# EAGLE design Backplate (EAGLE 8.0.0)
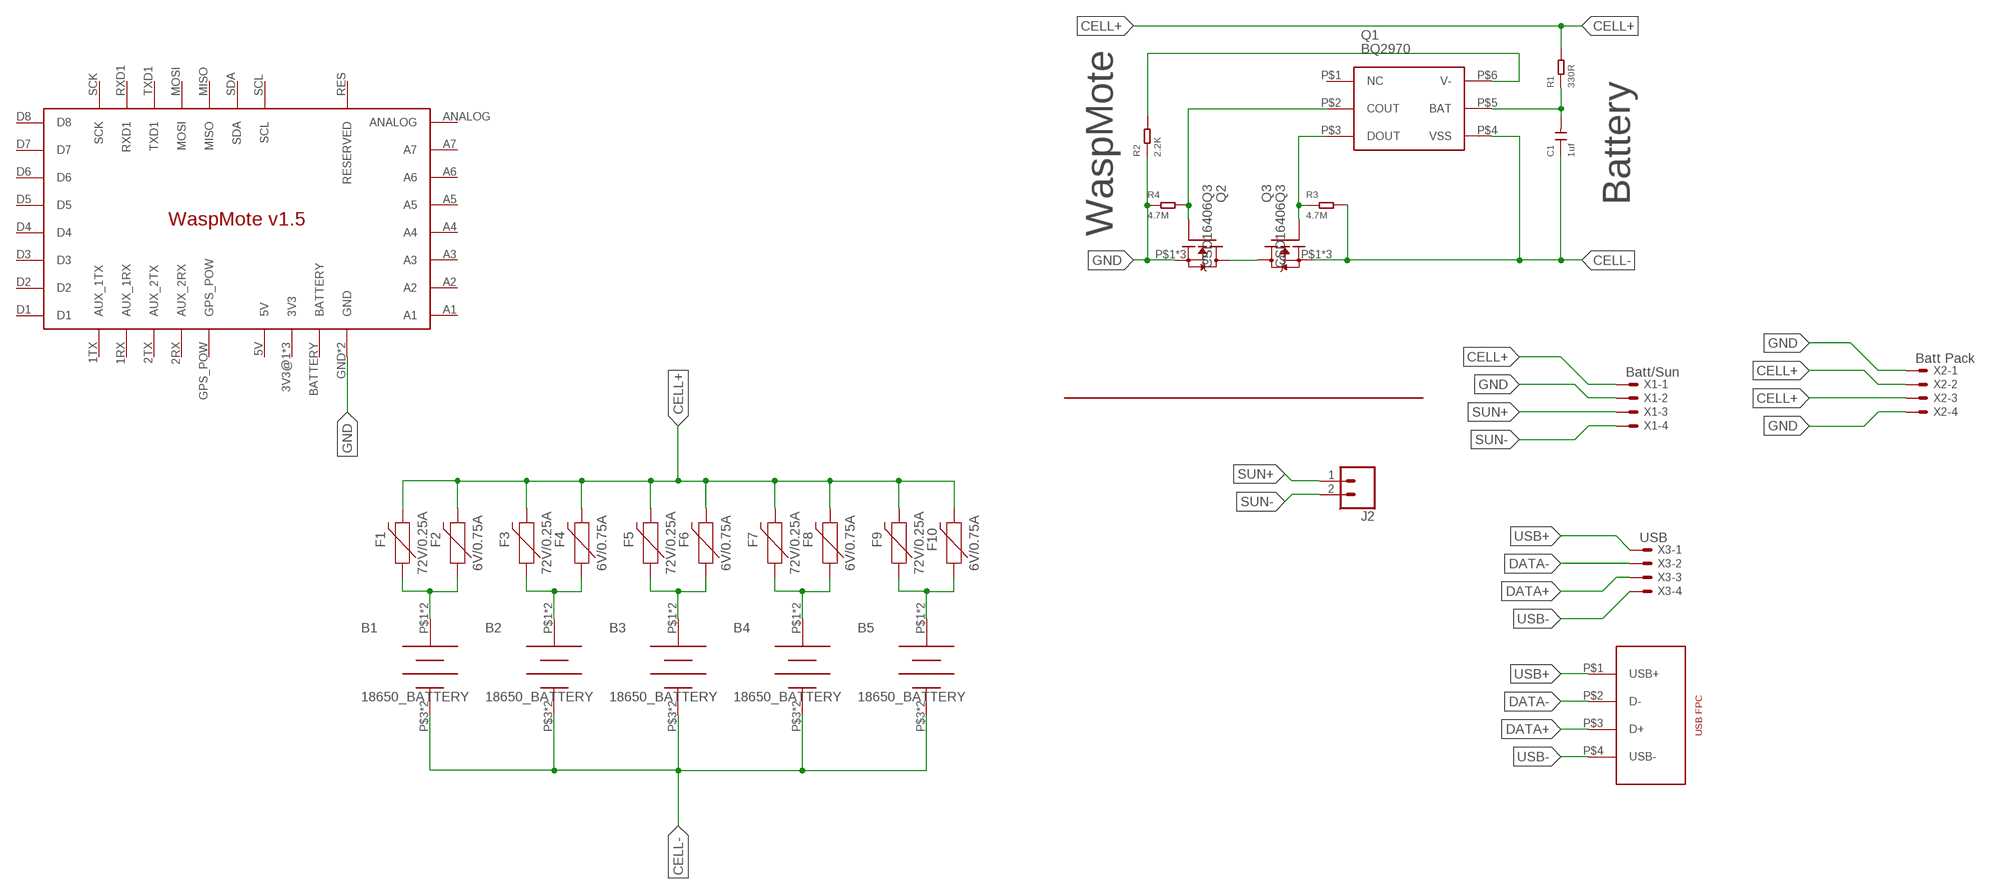
[diagram p0: schematic, sheet 1]

## Parts
B1  18650_BATTERY  [18650_BATTERY_HOLDER]
B2  18650_BATTERY  [18650_BATTERY_HOLDER]
B3  18650_BATTERY  [18650_BATTERY_HOLDER]
B4  18650_BATTERY  [18650_BATTERY_HOLDER]
B5  18650_BATTERY  [18650_BATTERY_HOLDER]
C1  1uf  CERAMIC-1UF-25V-10%-X7R(0603)  [C0603]
F1  72V/0.25A  PPTC_PTH  [PTH]
F2  6V/0.75A  PPTC_THREE-QUARTER-AMP  [1206]
F3  72V/0.25A  PPTC_PTH  [PTH]
F4  6V/0.75A  PPTC_THREE-QUARTER-AMP  [1206]
F5  72V/0.25A  PPTC_PTH  [PTH]
F6  6V/0.75A  PPTC_THREE-QUARTER-AMP  [1206]
F7  72V/0.25A  PPTC_PTH  [PTH]
F8  6V/0.75A  PPTC_THREE-QUARTER-AMP  [1206]
F9  72V/0.25A  PPTC_PTH  [PTH]
F10  6V/0.75A  PPTC_THREE-QUARTER-AMP  [1206]
J1  USB_FTP  [1MM_FPC]
J2  CONN_023.5MM_LOCK  [SCREWTERMINAL-3.5MM-2_LOCK]
Q1  BQ2970  [WSON-6]
Q2  CSD16406Q3  [CSD16406Q3]
Q3  CSD16406Q3  [CSD16406Q3]
R1  330R  SMD-RES-330R-1%-1/10W(0603)  [R0603]
R2  2.2K  SMD-RES-2.2K-5%-1/10W(0603)  [R0603]
R3  4.7M  SMD-RES-4.7M-5%-1/10W(0603)  [R0603]
R4  4.7M  SMD-RES-4.7M-5%-1/10W(0603)  [R0603]
U$12  WASPMOTE_V1.5  [WASPMOTE_V1.5]
X1  Batt/Sun  22-23-2041  [22-23-2041]
X2  Batt Pack  22-23-2041  [22-23-2041]
X3  USB  22-23-2041  [22-23-2041]

## Nets
CELL+: F1.P$2 F2.2 F3.P$2 F4.2 F5.P$2 F6.2 F7.P$2 F8.2 F9.P$2 F10.2 R1.2 X1.1 X2.2 X2.3
CELL-: B1.P$3(BATT-) B1.P$4(BATT-) B2.P$3(BATT-) B2.P$4(BATT-) B3.P$3(BATT-) B3.P$4(BATT-) B4.P$3(BATT-) B4.P$4(BATT-) B5.P$3(BATT-) B5.P$4(BATT-) C1.1 Q1.P$4(VSS) Q3.P$1(S) Q3.P$2(S) Q3.P$3(S) R3.2
D: Q2.P$5(D) Q2.P$6(D) Q2.P$7(D) Q2.P$8(D) Q3.P$5(D) Q3.P$6(D) Q3.P$7(D) Q3.P$8(D)
DATA+: J1.P$3(D+) X3.3
DATA-: J1.P$2(D-) X3.2
GND: Q2.P$1(S) Q2.P$2(S) Q2.P$3(S) R2.1 R4.1 U$12.GND U$12.GND_2(GND) X1.2 X2.1 X2.4
N$2: Q1.P$3(DOUT) Q3.P$4(G) R3.1
N$3: B1.P$1(BATT+) B1.P$2(BATT+) F1.P$1 F2.1
N$4: B2.P$1(BATT+) B2.P$2(BATT+) F3.P$1 F4.1
N$5: B3.P$1(BATT+) B3.P$2(BATT+) F5.P$1 F6.1
N$6: B4.P$1(BATT+) B4.P$2(BATT+) F7.P$1 F8.1
N$7: B5.P$1(BATT+) B5.P$2(BATT+) F9.P$1 F10.1
N$8: Q1.P$2(COUT) Q2.P$4(G) R4.2
N$10: Q1.P$6(V-) R2.2
N$12: C1.2 Q1.P$5(BAT) R1.1
SUN+: J2.1 X1.3
SUN-: J2.2 X1.4
USB+: J1.P$1(USB+) X3.1
USB-: J1.P$4(USB-) X3.4
Unconnected: Q1.P$1(NC) U$12.1RX(AUX_1RX) U$12.1TX(AUX_1TX) U$12.2RX(AUX_2RX) U$12.2TX(AUX_2TX) U$12.3V3@1(3V3) U$12.3V3@2(3V3) U$12.3V3@3(3V3) U$12.5V U$12.A1 U$12.A2 U$12.A3 U$12.A4 U$12.A5 U$12.A6 U$12.A7 U$12.ANALOG U$12.BATTERY U$12.D1 U$12.D2 U$12.D3 U$12.D4 U$12.D5 U$12.D6 U$12.D7 U$12.D8 U$12.GPS_POW U$12.MISO U$12.MOSI U$12.RES(RESERVED) U$12.RXD1 U$12.SCK U$12.SCL U$12.SDA U$12.TXD1

## Notes on the sheet
- WaspMote | Battery

## Library data of the parts
B1-B5 = UIO-John:18650_BATTERY
C1 = Seeed-Capacitor:CERAMIC-1UF-25V-10%-X7R(0603): 302010139; MPN: CC0603KRX7R8BB105
F1 F3 F5 F7 F9 = SparkFun-Fuses:PPTC: Resettable Fuse PPTC Resettable Fuse. Really a sort of resistor with a polymeric positive temperature coefficient whose resistance increases dramatically with an increase in temperature. When heated by the power passing through the resistance rises causing the current to be limited, protecting the circuit. This is achieved by the transition of the polymer from a crystalline to an amorphous state where the conductive carbon separates breaking the conductive pathways found in the cool crystalline structure. When a PPTC cools back down it resumes conducting letting the circuit turn back on. SparkFun Products: SparkFun RedBoard - Programmed with Arduino <https://www.sparkfun.com/products/12757> Pro Micro - 5V/16MHz <https://www.sparkfun.com/products/12640> Arduino Pro 328 - 5V/16MHz <https://www.sparkfun.com/products/10915> MP3 Trigger <https://www.sparkfun.com/products/13720>; PROD_ID: RES-08490
F2 F4 F6 F8 F10 = SparkFun-Fuses:PPTC: Resettable Fuse PPTC Resettable Fuse. Really a sort of resistor with a polymeric positive temperature coefficient whose resistance increases dramatically with an increase in temperature. When heated by the power passing through the resistance rises causing the current to be limited, protecting the circuit. This is achieved by the transition of the polymer from a crystalline to an amorphous state where the conductive carbon separates breaking the conductive pathways found in the cool crystalline structure. When a PPTC cools back down it resumes conducting letting the circuit turn back on. SparkFun Products: SparkFun RedBoard - Programmed with Arduino <https://www.sparkfun.com/products/12757> Pro Micro - 5V/16MHz <https://www.sparkfun.com/products/12640> Arduino Pro 328 - 5V/16MHz <https://www.sparkfun.com/products/10915> MP3 Trigger <https://www.sparkfun.com/products/13720>; PROD_ID: RES-11150
J1 = UIO-John:USB_FTP
J2 = SparkFun-Connectors:CONN_02: Multi connection point. Often used as Generic Header-pin footprint for 0.1 inch spaced/style header connections On any of the 0.1 inch spaced packages, you can populate with these: Break Away Headers - Straight <https://www.sparkfun.com/products/116> (PRT-00116) Break Away Male Headers - Right Angle <https://www.sparkfun.com/products/553> (PRT-00553) Female Headers <https://www.sparkfun.com/products/115> (PRT-00115) Break Away Headers - Machine Pin <https://www.sparkfun.com/products/117> (PRT-00117) Break Away Female Headers - Swiss Machine Pin <https://www.sparkfun.com/products/743> (PRT-00743) For SCREWTERMINALS and SPRING TERMINALS visit here: Screw Terimnals on SparkFun.com <https://www.sparkfun.com/search/results?term=Screw+Terminals> (5mm/3.5mm/2.54mm spacing) This device is also useful as a general connection point to wire up your design to another part of your project. Our various solder wires solder well into these plated through hole pads. Hook-Up Wire - Assortment (Stranded, 22 AWG) <https://www.sparkfun.com/products/11375> (PRT-11375) Hook-Up Wire - Assortment (Solid Core, 22 AWG) <https://www.sparkfun.com/products/11367> (PRT-11367) View the entire wire category on our website here <https://www.sparkfun.com/categories/141> Special notes: Molex polarized connector foot print use with: PRT-08233 with associated crimp pins and housings. 2.54_SCREWTERM for use with PRT-10571. 3.5mm Screw Terminal footprints for PRT-08084 5mm Screw Terminal footprints for use with PRT-08432; PROD_ID: CONN-08399
Q1 = UIO-John:BQ2970: BQ2970 Li-Ion/Li Polymer Advanced Single-Cell Battery Protector IC Family; MPN: BQ2970
Q2 Q3 = UIO-John:CSD16406Q3: CSD16406Q3 N-Channel NexFET™ Power MOSFET; MPN: CSD16406Q3
R1 = Seeed-Resistor:SMD-RES-330R-1%-1/10W(0603): 301010300; MPN: RC0603FR-07330RL
R2 = Seeed-Resistor:SMD-RES-2.2K-5%-1/10W(0603): 301010124; MPN: RC0603JR-072K2L
R3 R4 = Seeed-Resistor:SMD-RES-4.7M-5%-1/10W(0603): 301010213; MPN: RC0603JR-074M7L
U$12 = UIO-John:WASPMOTE_V1.5: WaspMote v1.5 (c) 2017 john.hulth@geo.uio.no
X1-X3 = con-molex:22-23-2041: .100" (2.54mm) Center Header - 4 Pin; MF: MOLEX; MPN: 22-23-2041; OC_FARNELL: 1462920; OC_NEWARK: 38C0355

## Module WSON-6
Ports: 

### Library data of the parts

## Board
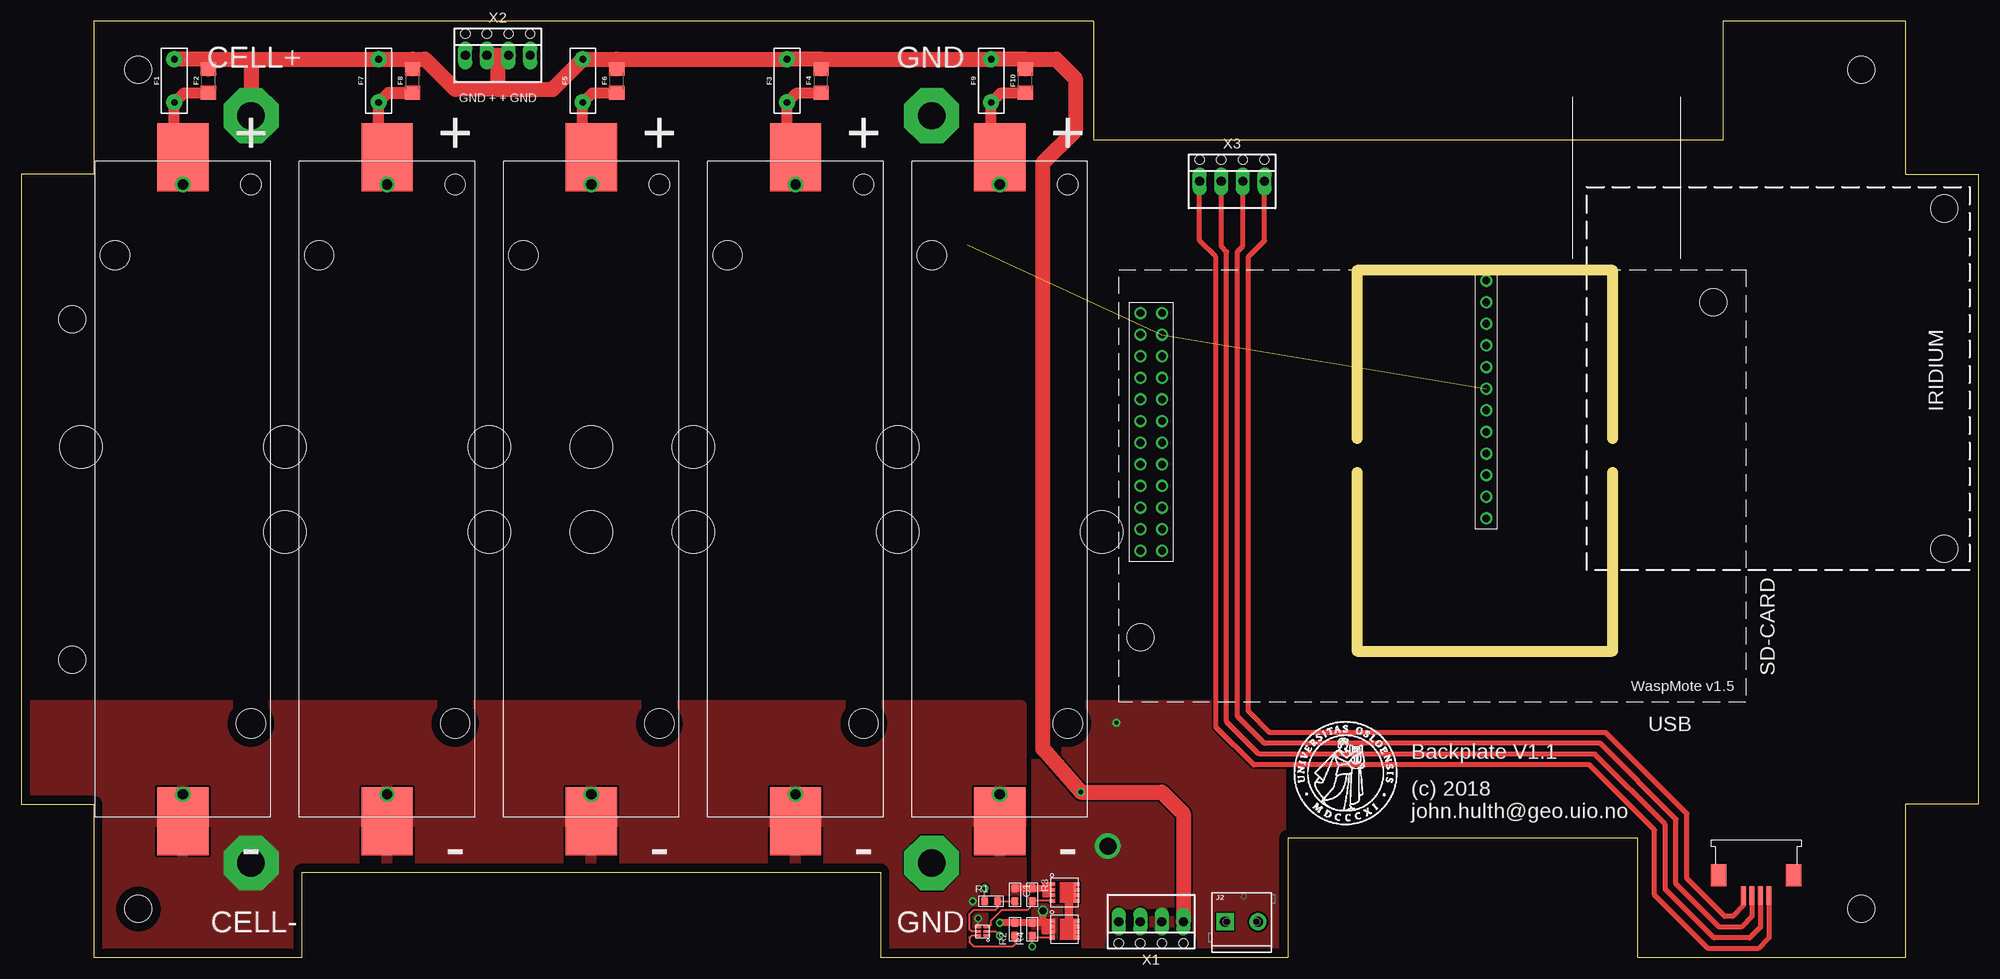
[diagram p1: board, top side]
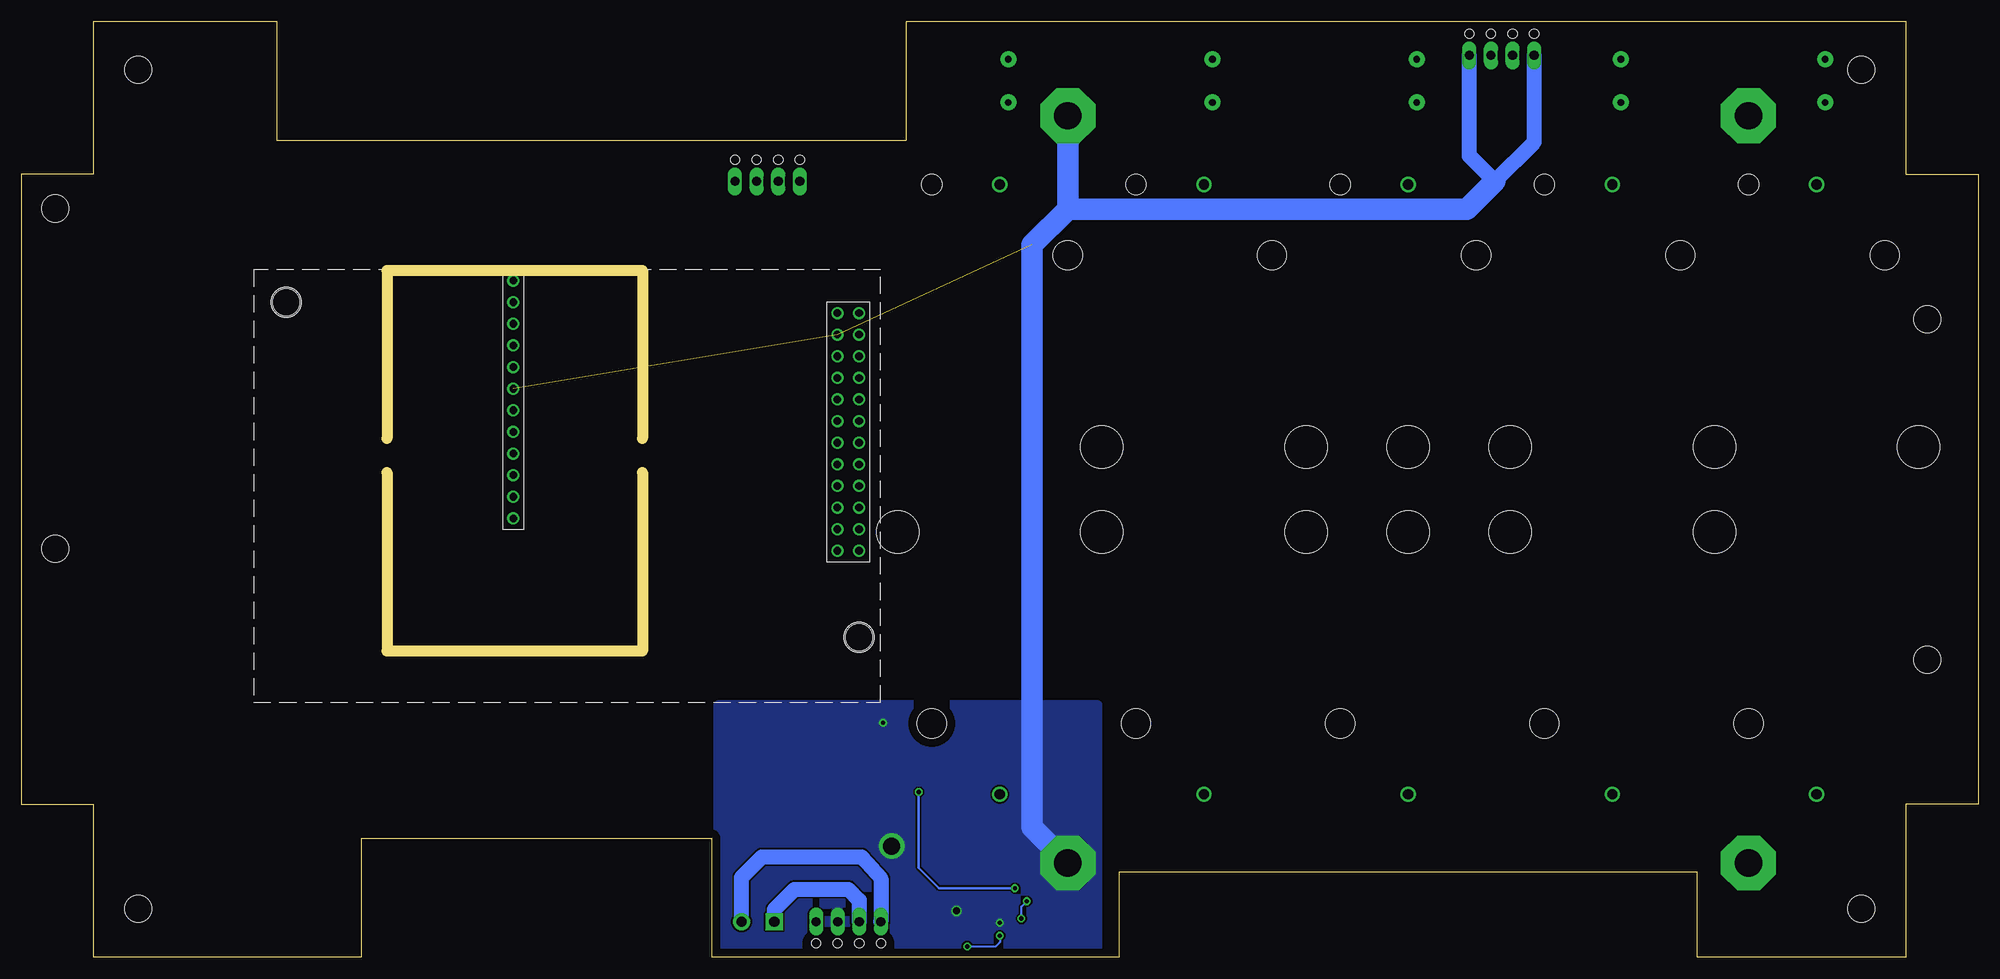
[diagram p2: board, bottom side, seen from below]

Size 230 x 110 mm. Coordinates in mm from the lower left corner, seen from the top.
Outline: 8.5,0 33,0 33,10 101,10 101,0 148.86,0 148.86,14 190,14 190,0 221.5,0 221.5,18 230,18 230,92 221.5,92 221.5,110 200,110 200,96 126,96 126,110 8.5,110 8.5,92 0,92 0,18 8.5,18 8.5,0
Copper layers (1*16): Top 0.035mm / dielectric 1.5mm / Bottom 0.035mm
Design rules "default": minimum track width 10mil, minimum drill 24mil, track to track 8mil, track to pad 8mil, pad to pad 8mil, via to via 8mil, smd to smd 8mil, copper to edge 40mil, drill to drill 8mil, minimum pad ring 10mil, minimum via ring 8mil, stop-mask expansion 4mil, vias tented up to drill 0mil, thermal gap 10mil
Holes 3.2 mm at 216.25,5.7 216.25,104.3 13.75,104.3 13.75,5.7 226,88 226,48 6,75 6,35 131.55,37.63 198.85,77
Holes 5 mm at 67,60 67,50
Milling: 6 lines

### Footprints (pad centres in the part's own frame; a part is rotated, then mirrored left to right if it is on the bottom)
18650_BATTERY_HOLDER = drill 1.2: P$1 0,35.82; P$3 0,-35.82 | smd 6 x 8: P$2 0,39; P$4 0,-39 | hole 3.45: 8,-27.5; -8,27.5 | hole 2.4: 8,35.82 | hole 5: 12,-5; -12,5
C0603 = smd 0.889 x 0.889: 1 0,0.762; 2 0,-0.762
PTH = drill 0.8 pad 1.88: P$1 -2.54,0; P$2 2.54,0
1206 = smd 1.6 x 1.8: 1 -1.4,0; 2 1.4,0
1MM_FPC = smd 0.6 x 2.2: P$1 -1.5,2; P$2 -0.5,2; P$3 0.5,2; P$4 1.5,2 | smd 1.8 x 2.6: P$5 -4.4,-0.4; P$6 4.4,-0.4
SCREWTERMINAL-3.5MM-2_LOCK = drill 1.2 pad 2.032 square: 1 -0.178,0 | drill 1.2 pad 2.032: 2 3.678,0
WSON-6 = smd 0.28 x 0.8: P$1 -0.5,-0.5 | smd 0.28 x 0.75: P$2 0,-0.525; P$3 0.5,-0.525; P$4 0.5,0.525; P$5 0,0.525; P$6 -0.5,0.525
CSD16406Q3 = smd 0.5 x 0.63: P$1 -0.975,-1.435; P$2 -0.325,-1.435; P$3 0.325,-1.435; P$4 0.975,-1.435; P$5 0.975,1.435; P$6 0.325,1.435; P$7 -0.325,1.435; P$8 -0.975,1.435
R0603 = smd 0.889 x 0.889: 1 0,0.762; 2 0,-0.762
WASPMOTE_V1.5 = drill 0.9: 1RX 43.18,46.99; 1TX 43.18,49.53; 2RX 43.18,44.45; 2TX 43.18,41.91; 3V3@1 5.08,45.72; 3V3@2 2.54,22.86; 3V3@3 43.18,26.67; 5V 5.08,20.32; A1 5.08,22.86; A2 2.54,25.4; A3 5.08,25.4; A4 2.54,27.94; A5 5.08,27.94; A6 2.54,30.48; A7 5.08,30.48; ANALOG 2.54,45.72; BATTERY 43.18,39.37; D1 5.08,33.02; D2 2.54,35.56; D3 5.08,35.56; D4 2.54,38.1; D5 5.08,38.1; D6 2.54,40.64; D7 5.08,40.64; D8 2.54,43.18; GND 5.08,43.18; GND_2 43.18,36.83; GPS_POW 2.54,20.32; MISO 43.18,21.59; MOSI 43.18,24.13; RES 2.54,33.02; RXD1 43.18,31.75; SCK 43.18,34.29; SCL 5.08,17.78; SDA 2.54,17.78; TXD1 43.18,29.21
22-23-2041 = drill 1.1 pad 1.422 long: 1 -3.81,0; 2 -1.27,0; 3 1.27,0; 4 3.81,0 | hole 1.1: -3.81,2.54; -1.27,2.54; 1.27,2.54; 3.81,2.54

### Placement (x,y rotation side)
B1  19,55 0 top
B2  91,55 0 top
B3  67,55 0 top
B4  43,55 0 top
B5  115,55 0 top
C1  116.78,7.38 0 top
F1  18,103 90 top
F2  22,103 90 top
F3  90,103 90 top
F4  94,103 90 top
F5  66,103 90 top
F6  70,103 90 top
F7  42,103 90 top
F8  46,103 90 top
F9  114,103 90 top
F10  118,103 90 top
J1  203.9,9.28 180 top
J2  141.67,4.2 0 top
Q1  112.97,3.06 90 top
Q2  122.62,3.31 270 top
Q3  122.62,7.63 270 top
R1  113.98,6.61 270 top
R2  116.78,3.31 0 top
R3  118.81,7.38 180 top
R4  118.81,3.31 0 top
U$1  [UIO-LOGO-BL]  149.32,15.33 0 top
U$12  129,30 0 top
X1  132.78,4.2 180 top
X2  56,106 0 top
X3  142.31,91.19 0 top

### Tracks (layer width: path | path; a pad name or v marks a point on that pad's centre or on a via)
CELL+  (via drill 0.5, 3.2 pad 6.45)
  Top 0.254: R1.2 v113.22,8.14
  Top 1.27: 118.12,104.28 F10.2
  Top 1.778: 27,105.54 v27,98.9 | 27,105.54 F7.P$2 46,105.54 | 22,105.54 F1.P$2 | 22,105.54 27,105.54 | F2.2 22,105.54 | 70,105.54 F5.P$2 62.46,102 56,102 | 70,105.54 F3.P$2 94,105.54 | 94,105.54 F9.P$2 118,105.54 | 118,105.54 121.61,105.54 123.89,103.26 123.89,97.16 120.08,93.35 120.08,24.52 v124.53,19.44 134.05,19.44 136.59,16.9 X1.1 | F10.2 118,105.54 | F4.2 94,105.54 | F6.2 70,105.54 | F8.2 46,105.54 | X2.2 56,106 | 56,106 X2.3 | 46,105.54 47.46,105.54 51,102 56,102 | 56,106 56,102
  Bottom 0.305: 113.22,8.26 v113.22,8.14 122.11,8.14 124.53,10.55 v124.53,19.44
CELL-  (via drill 0.5, 3.2 pad 6.45)
  Top 0.254: Q1.P$4 112.46,3.57 v112.46,4.58
  Top 0.406: 120.59,7.95 Q3.P$2 | 120.59,7.95 120.33,7.95 120.33,8.14 120.33,8.6 Q3.P$1 | Q3.P$3 120.59,7.3 120.59,7.95
  Top 0.813: 120.33,8.14 R3.2 C1.1
  Bottom 0.254: v112.46,4.58 112.46,5.98 v111.83,6.61
  other vias: 27,11.1
  pour Top: 0,29.6 0,0 117.54,0 117.54,29.6
D
  Top 0.406: Q2.P$5 123.13,2.34 123.13,3.06 | Q3.P$8 123.13,8.6 123.13,7.88 | 123.13,3.56 123.13,3.06 | 123.13,3.56 123.13,4.33 124.06,4.33 Q2.P$8 | 123.13,7.38 123.13,6.61 124.06,6.61 Q3.P$5 | 123.13,7.88 123.13,7.38 | Q2.P$6 124.06,3.06 123.13,3.06 | Q2.P$7 124.06,3.56 123.13,3.56 | Q3.P$6 124.06,7.38 123.13,7.38 | Q3.P$7 124.06,7.88 123.13,7.88
  Top 1.016: 123.13,4.33 123.13,6.61
DATA+
  Top 0.61: J1.P$3 203.4,4.84 202.13,3.56 199.56,3.56 194.49,8.65 194.49,16.27 185.59,25.16 146.12,25.16 142.94,28.33 142.94,82.94 143.57,83.58 X3.3
DATA-
  Top 0.61: J1.P$2 204.4,3.56 203.13,2.3 198.93,2.3 193.22,8.01 193.22,15.63 184.96,23.89 145.48,23.89 141.67,27.7 141.67,82.94 141.03,83.58 X3.2
GND  (via drill 0.5, 0.8, 2, 3.2 pad 6.45)  (2 unrouted)
  Top 0.406: Q2.P$3 120.08,2.99 120.08,3.64 | 120.08,3.64 120.08,4.07 120.08,4.29 Q2.P$1 | Q2.P$2 120.08,3.64
  Top 0.813: v120.08,5.47 120.08,4.07 R4.1 R2.1 v115,4.07
  Bottom 1.778: X2.1 52.19,95.81 56.81,91.19 59.81,94.19 X2.4
  Bottom 2.54: v107,98.9 107,87.91 | 107,87.91 111.19,83.72 111.19,15.29 v107,11.1 | 107,87.91 60.09,87.91 56.81,91.19
  other vias: 128.72,27.57 127.7,13.09
  pour Top: 119.32,0 148.02,0 148.02,29.6 119.32,29.6
  pour Bottom: 103.57,29.6 148.02,29.6 148.02,0 103.57,0
N$2
  Top 0.254: Q1.P$3 113.72,3.56 113.98,3.82 113.98,4.33 115.25,5.6 118.3,5.6 118.81,6.1 R3.1 118.85,6.65 Q3.P$4
N$3
  Top 1.27: B1.P$1 B1.P$2 18,94 F1.P$1 19.14,101.6 F2.1
N$4
  Top 1.27: F4.1 91.14,101.6 F3.P$1 90,95 B2.P$2 B2.P$1
N$5
  Top 1.27: F6.1 67.14,101.6 F5.P$1 66,95 B3.P$2 B3.P$1
N$6
  Top 1.27: 43.14,101.6 F7.P$1 42,95 B4.P$2 B4.P$1
  Top 1.422: 43.14,101.6 F8.1
N$7
  Top 1.27: F10.1 115.14,101.6 F9.P$1 114,96 115,95 B5.P$2 B5.P$1
N$8  (via drill 0.5)
  Top 0.254: v118.81,1.28 R4.2 119.02,2.34 Q2.P$4 | Q1.P$2 114.49,3.06 v115,2.55
  Top 0.406: R4.2 119.06,2.59
  Bottom 0.254: v115,2.55 115,1.79 115.51,1.28 v118.81,1.28
N$10
  Top 0.254: R2.2 116.78,1.53 116.52,1.28 111.95,1.28 111.44,1.79 111.44,2.32 111.68,2.56 Q1.P$6
N$12
  Top 0.254: C1.2 R1.1 114.75,5.85 114.49,5.6 111.95,5.6 111.44,5.09 111.44,3.31 111.7,3.06 Q1.P$5
SUN+
  Bottom 1.778: X1.3 131.51,6.74 132.78,8.01 139.13,8.01 141.49,5.65 J2.1
SUN-
  Bottom 1.778: X1.4 128.97,9.28 131.24,11.82 142.94,11.82 145.35,9.41 J2.2
USB+
  Top 0.61: J1.P$1 205.4,2.3 204.13,1.02 198.3,1.02 191.94,7.38 191.94,14.99 184.32,22.62 144.84,22.62 140.4,27.06 140.4,82.31 138.5,84.21 X3.1
USB-
  Top 0.61: J1.P$4 202.4,6.1 201.13,4.84 200.2,4.84 195.75,9.28 195.75,16.9 186.23,26.43 146.75,26.43 144.21,28.96 144.21,82.31 146.12,84.21 X3.4

### Text on the board
tPlace: GND + + GND | IRIDIUM | Backplate V1.1 | (c) 2018 / john.hulth@geo.uio.no
tNames: CELL+ | GND | CELL- | GND